# EAGLE design untitled (EAGLE 7.2.0)
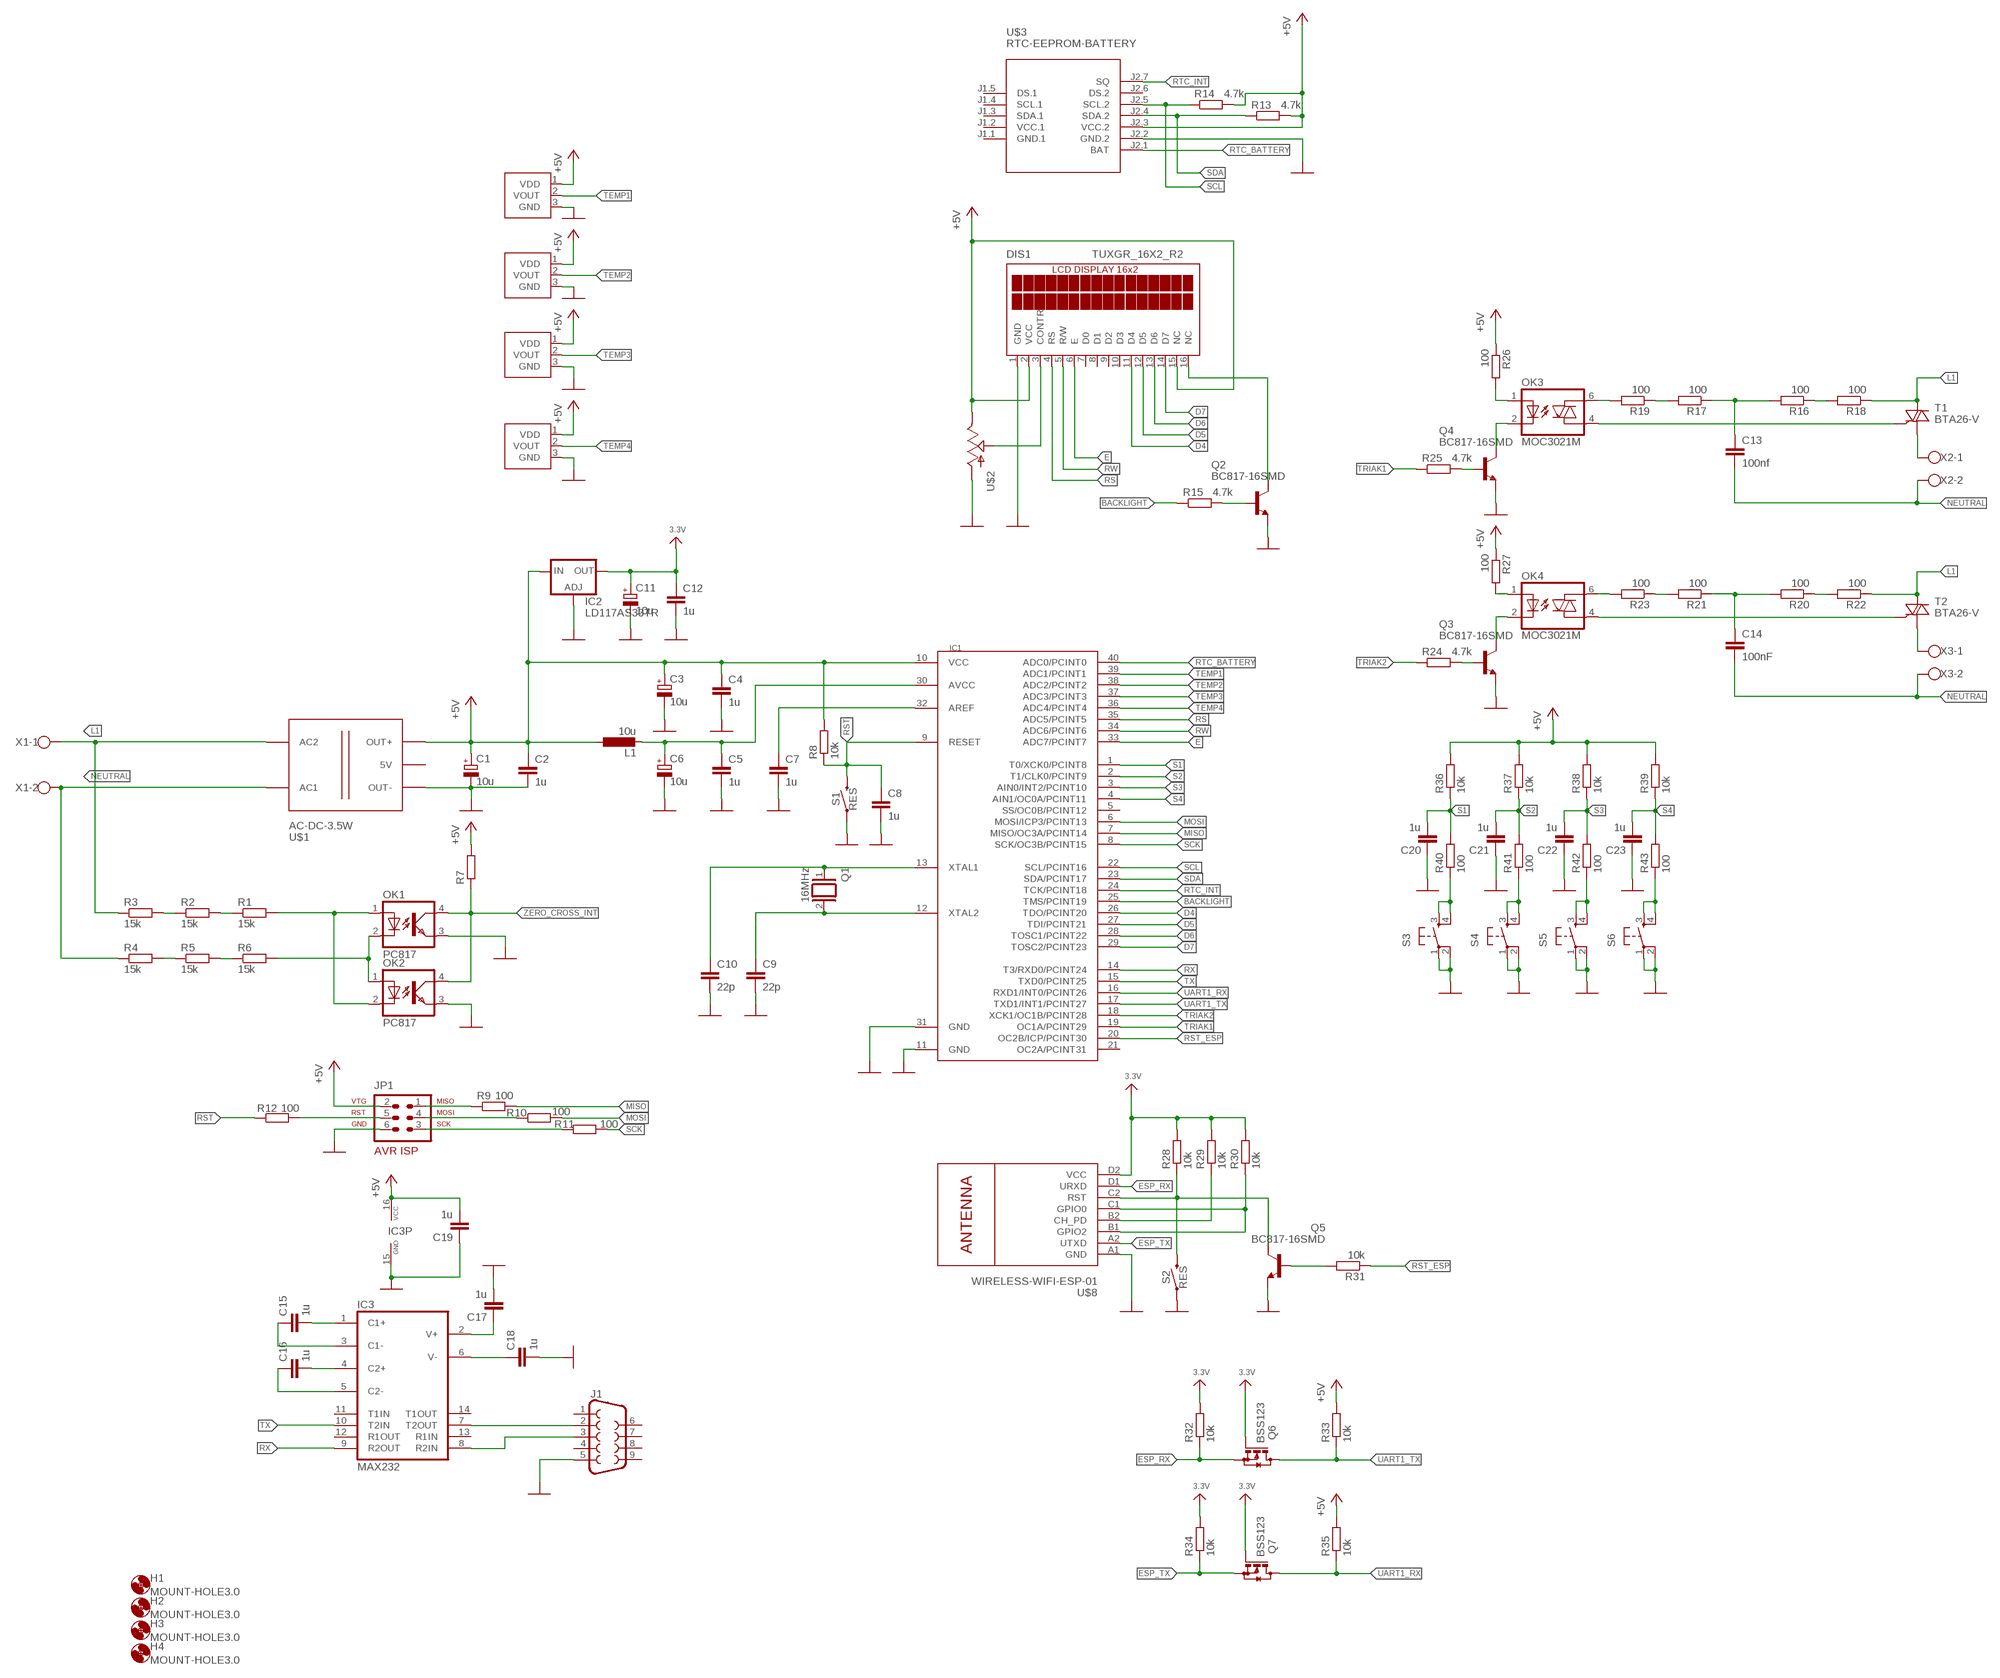
[diagram p0: schematic, sheet 1]

## Parts
C1  10u  CPOL-EU153CLV-0505  [153CLV-0505]
C2  1u  C-EUC1206  [C1206]
C3  10u  CPOL-EU153CLV-0505  [153CLV-0505]
C4  1u  C-EUC1206  [C1206]
C5  1u  C-EUC1206  [C1206]
C6  10u  CPOL-EU153CLV-0505  [153CLV-0505]
C7  1u  C-EUC1206  [C1206]
C8  1u  C-EUC1206  [C1206]
C9  22p  C-EUC1206  [C1206]
C10  22p  C-EUC1206  [C1206]
C11  10u  CPOL-EU153CLV-0505  [153CLV-0505]
C12  1u  C-EUC1206  [C1206]
C13  100nf  C-EU150-064X183  [C150-064X183]
C14  100nF  C-EU150-064X183  [C150-064X183]
C15  1u  C-EUC1206  [C1206]
C16  1u  C-EUC1206  [C1206]
C17  1u  C-EUC1206  [C1206]
C18  1u  C-EUC1206  [C1206]
C19  1u  C-EUC1206  [C1206]
C20  1u  C-EUC1206  [C1206]
C21  1u  C-EUC1206  [C1206]
C22  1u  C-EUC1206  [C1206]
C23  1u  C-EUC1206  [C1206]
DIS1  TUXGR_16X2_R2  [TUXGR_16X2_R2]
H1  MOUNT-HOLE3.0  [3,0]
H2  MOUNT-HOLE3.0  [3,0]
H3  MOUNT-HOLE3.0  [3,0]
H4  MOUNT-HOLE3.0  [3,0]
IC1  MEGA1284P  [DIL40]
IC2  LD117AS33TR  [SOT223]
IC3  MAX232  [DIL16]
J1  DB9FEMALE  [DB9]
JP1  AVR-ISP-6  [AVR-ISP-6]
L1  10u  L-EU0204/5  [0204/5]
OK1  PC817  [DIL04]
OK2  PC817  [DIL04]
OK3  MOC3021M  [DIL06]
OK4  MOC3021M  [DIL06]
Q1  16MHz  XTAL/S  [QS]
Q2  BC817-16SMD  [SOT23-BEC]
Q3  BC817-16SMD  [SOT23-BEC]
Q4  BC817-16SMD  [SOT23-BEC]
Q5  BC817-16SMD  [SOT23-BEC]
Q6  BSS123  [SOT23]
Q7  BSS123  [SOT23]
R1  15k  R-EU_M1206  [M1206]
R2  15k  R-EU_M1206  [M1206]
R3  15k  R-EU_M1206  [M1206]
R4  15k  R-EU_M1206  [M1206]
R5  15k  R-EU_M1206  [M1206]
R6  15k  R-EU_M1206  [M1206]
R7  R-EU_M1206  [M1206]
R8  10k  R-EU_M1206  [M1206]
R9  100  R-EU_M1206  [M1206]
R10  100  R-EU_M1206  [M1206]
R11  100  R-EU_M1206  [M1206]
R12  100  R-EU_M1206  [M1206]
R13  4.7k  R-EU_M1206  [M1206]
R14  4.7k  R-EU_M1206  [M1206]
R15  4.7k  R-EU_M1206  [M1206]
R16  100  R-EU_M1206  [M1206]
R17  100  R-EU_M1206  [M1206]
R18  100  R-EU_M1206  [M1206]
R19  100  R-EU_M1206  [M1206]
R20  100  R-EU_M1206  [M1206]
R21  100  R-EU_M1206  [M1206]
R22  100  R-EU_M1206  [M1206]
R23  100  R-EU_M1206  [M1206]
R24  4.7k  R-EU_M1206  [M1206]
R25  4.7k  R-EU_M1206  [M1206]
R26  100  R-EU_M1206  [M1206]
R27  100  R-EU_M1206  [M1206]
R28  10k  R-EU_M1206  [M1206]
R29  10k  R-EU_M1206  [M1206]
R30  10k  R-EU_M1206  [M1206]
R31  10k  R-EU_M1206  [M1206]
R32  10k  R-EU_M1206  [M1206]
R33  10k  R-EU_M1206  [M1206]
R34  10k  R-EU_M1206  [M1206]
R35  10k  R-EU_M1206  [M1206]
R36  10k  R-EU_M1206  [M1206]
R37  10k  R-EU_M1206  [M1206]
R38  10k  R-EU_M1206  [M1206]
R39  10k  R-EU_M1206  [M1206]
R40  100  R-EU_M1206  [M1206]
R41  100  R-EU_M1206  [M1206]
R42  100  R-EU_M1206  [M1206]
R43  100  R-EU_M1206  [M1206]
S1  RES  MOMENTARY-SWITCH-SPST-SMD-6.0X3.5MM  [TACTILE_SWITCH_SMD_6.0X3.5MM]
S2  RES  MOMENTARY-SWITCH-SPST-SMD-6.0X3.5MM  [TACTILE_SWITCH_SMD_6.0X3.5MM]
S3  TAC_SWITCHPTH  [TACTILE-PTH]
S4  TAC_SWITCHPTH  [TACTILE-PTH]
S5  TAC_SWITCHPTH  [TACTILE-PTH]
S6  TAC_SWITCHPTH  [TACTILE-PTH]
T1  BTA26-V  [TOP3S-1]
T2  BTA26-V  [TOP3S-1]
U$1  AC-DC-3.5W  [AC-DC-3.5W]
U$2  POTTRIM  [TRIM_POT]
U$3  RTC-EEPROM-BATTERY  [RTC-EEPROM-BATTERY]
U$4  MCP970XTO  [TO92]
U$5  MCP970XTO  [TO92]
U$6  MCP970XTO  [TO92]
U$7  MCP970XTO  [TO92]
U$8  WIRELESS-WIFI-ESP-01  [WIRELESS-WIFI-ESP-01]
X1  AK500/2  [AK500/2]
X2  AK500/2  [AK500/2]
X3  AK500/2  [AK500/2]

## Nets
3.3V: C11.+ C12.1 IC2.4(OUT) Q6.1(G) Q7.1(G) R28.2 R29.2 R30.2 R32.2 R34.2 U$8.D2(VCC)
+5V: C1.+ C2.1 C3.+ C4.1 C19.2 DIS1.2(VCC) DIS1.15(NC) IC1.10(VCC) IC2.3(IN) IC3.16(VCC) JP1.2 L1.1 R7.2 R8.2 R13.2 R14.2 R26.1 R27.1 R33.2 R35.2 R36.2 R37.2 R38.2 R39.2 U$1.J2.3(OUT+) U$2.2(E) U$3.J2.3(VCC.2) U$4.1(VDD) U$5.1(VDD) U$6.1(VDD) U$7.1(VDD)
BACKLIGHT: IC1.25(TMS/PCINT19) R15.1
D4: DIS1.11(D4) IC1.26(TDO/PCINT20)
D5: DIS1.12(D5) IC1.27(TDI/PCINT21)
D6: DIS1.13(D6) IC1.28(TOSC1/PCINT22)
D7: DIS1.14(D7) IC1.29(TOSC2/PCINT23)
E: DIS1.6(E) IC1.33(ADC7/PCINT7)
ESP_RST: Q5.C R28.1 S2.2 U$8.C2(RST)
ESP_RX: Q6.2(S) R32.1 U$8.D1(URXD)
ESP_TX: Q7.2(S) R34.1 U$8.A2(UTXD)
GND: C1.- C2.2 C3.- C4.2 C5.2 C6.- C7.2 C8.2 C9.2 C10.2 C11.- C12.2 C17.2 C18.2 C19.1 C20.1 C21.1 C22.1 C23.1 DIS1.1(GND) IC1.11(GND) IC1.31(GND) IC2.1(ADJ) IC3.15(GND) J1.5 JP1.6 OK1.3(EMIT) OK2.3(EMIT) Q2.E Q3.E Q4.E Q5.E S1.1 S2.1 S3.1 S3.2 S4.1 S4.2 S5.1 S5.2 S6.1 S6.2 U$1.J2.1(OUT-) U$2.3(A) U$3.J2.2(GND.2) U$4.3(GND) U$5.3(GND) U$6.3(GND) U$7.3(GND) U$8.A1(GND)
L1: R3.1 R18.1 R22.1 T1.A2 T2.A2 U$1.J1.2(AC2) X1.1
MISO: IC1.7(MISO/OC3A/PCINT14) R9.2
MOSI: IC1.6(MOSI/ICP3/PCINT13) R10.2
N$1: OK1.2(C) OK2.1(A) R6.2
N$2: OK1.1(A) OK2.2(C) R1.2
N$3: R2.1 R3.2
N$4: R1.1 R2.2
N$5: R5.2 R6.1
N$6: R4.2 R5.1
N$7: OK3.4(A1) T1.G
N$8: T1.A1 X2.1
N$9: C5.1 C6.+ IC1.30(AVCC) L1.2
N$10: JP1.5 R12.2
N$11: C9.1 IC1.12(XTAL2) Q1.2
N$12: C7.1 IC1.32(AREF)
N$13: C10.1 IC1.13(XTAL1) Q1.1
N$14: JP1.1 R9.1
N$15: JP1.4 R10.1
N$16: JP1.3 R11.1
N$17: Q2.B R15.2
N$18: DIS1.3(CONTR) U$2.1(S)
N$19: Q5.B R31.2
N$20: OK3.6(A2) R19.2
N$21: R17.2 R19.1
N$22: C13.1 R16.2 R17.1
N$23: R16.1 R18.2
N$24: OK4.6(A2) R23.2
N$25: R21.2 R23.1
N$26: C14.1 R20.2 R21.1
N$27: DIS1.16(NC) Q2.C
N$28: R20.1 R22.2
N$29: OK4.4(A1) T2.G
N$30: T2.A1 X3.1
N$31: OK3.1(A) R26.2
N$32: OK3.2(C) Q4.C
N$33: OK4.1(A) R27.2
N$34: OK4.2(C) Q3.C
N$35: Q3.B R24.2
N$36: Q4.B R25.2
N$37: R29.1 U$8.B2(CH_PD)
N$38: R30.1 U$8.B1(GPIO2) U$8.C1(GPIO0)
N$39: C15.2 IC3.1(C1+)
N$40: R40.1 S3.3 S3.4
N$41: C16.2 IC3.4(C2+)
N$42: R41.1 S4.3 S4.4
N$43: C15.1 IC3.3(C1-)
N$44: C16.1 IC3.5(C2-)
N$45: C17.1 IC3.2(V+)
N$46: C18.1 IC3.6(V-)
N$47: R42.1 S5.3 S5.4
N$48: R43.1 S6.3 S6.4
N$49: IC3.7(T2OUT) J1.2
N$50: IC3.8(R2IN) J1.3
NEUTRAL: C13.2 C14.2 R4.1 U$1.J1.1(AC1) X1.2 X2.2 X3.2
RS: DIS1.4(RS) IC1.35(ADC5/PCINT5)
RST: C8.1 IC1.9(RESET) R8.1 R12.1 S1.2
RST_ESP: IC1.20(OC2B/ICP/PCINT30) R31.1
RTC_BATTERY: IC1.40(ADC0/PCINT0) U$3.J2.1(BAT)
RTC_INT: IC1.24(TCK/PCINT18) U$3.J2.7(SQ)
RW: DIS1.5(R/W) IC1.34(ADC6/PCINT6)
RX: IC1.14(T3/RXD0/PCINT24) IC3.9(R2OUT)
S1: C20.2 IC1.1(T0/XCK0/PCINT8) R36.1 R40.2
S2: C21.2 IC1.2(T1/CLK0/PCINT9) R37.1 R41.2
S3: C22.2 IC1.3(AIN0/INT2/PCINT10) R38.1 R42.2
S4: C23.2 IC1.4(AIN1/OC0A/PCINT11) R39.1 R43.2
SCK: IC1.8(SCK/OC3B/PCINT15) R11.2
SCL: IC1.22(SCL/PCINT16) R14.1 U$3.J2.5(SCL.2)
SDA: IC1.23(SDA/PCINT17) R13.1 U$3.J2.4(SDA.2)
TEMP1: IC1.39(ADC1/PCINT1) U$7.2(VOUT)
TEMP2: IC1.38(ADC2/PCINT2) U$6.2(VOUT)
TEMP3: IC1.37(ADC3/PCINT3) U$5.2(VOUT)
TEMP4: IC1.36(ADC4/PCINT4) U$4.2(VOUT)
TRIAK1: IC1.19(OC1A/PCINT29) R25.1
TRIAK2: IC1.18(XCK1/OC1B/PCINT28) R24.1
TX: IC1.15(TXD0/PCINT25) IC3.10(T2IN)
UART1_RX: IC1.16(RXD1/INT0/PCINT26) Q7.3(D) R35.1
UART1_TX: IC1.17(TXD1/INT1/PCINT27) Q6.3(D) R33.1
ZERO_CROSS_INT: OK1.4(COL) OK2.4(COL) R7.1
Unconnected: DIS1.7(D0) DIS1.8(D1) DIS1.9(D2) DIS1.10(D3) IC1.5(SS/OC0B/PCINT12) IC1.21(OC2A/PCINT31) IC3.11(T1IN) IC3.12(R1OUT) IC3.13(R1IN) IC3.14(T1OUT) J1.1 J1.4 J1.6 J1.7 J1.8 J1.9 U$1.J2.2(5V) U$3.J1.3(SDA.1) U$3.J1.4(SCL.1) U$3.J1.5(DS.1) U$3.J2.6(DS.2)

## Power pins joined to a net without a drawn wire
GND.1: U$3.J1.1(GND.1)
VCC.1: U$3.J1.2(VCC.1)

## Library data of the parts
C1 C3 C6 C11 = rcl:CPOL-EU: POLARIZED CAPACITOR, European symbol
C2 C4 C5 C7-C10 C12-C23 = rcl:C-EU: CAPACITOR, European symbol
DIS1 = display-lcd:TUXGR_16X2_R2: Tuxgraphics LCD display 16x2 characters reflective, without background light Source: tuxgr_12x2_r2.pdf; OC_FARNELL: unknown; OC_NEWARK: unknown
H1-H4 = holes:MOUNT-HOLE: MOUNTING HOLE with drill center marker
IC1 = 1284p:MEGA1284P: Atmel ATmega1284P 8-bit AVR Microcontroller
IC2 = v-reg:LD117A?*: Low drop fixed and adjustable positive voltage regulators 1 A Source: http://www.st.com/stonline/products/literature/ds/7194/ld1117axx.pdf
IC3 = maxim:MAX232: RS232 TRANSEIVER; MF: MAXIM; MPN: MAX232ACPE+; OC_FARNELL: 9723773; OC_NEWARK: 68K4544
J1 = SparkFun-Connectors:DB9: DB9 Connector Standard DB9 (D-Sub 9) serial connector. Can be used for CAN bus as well as RS485 and RS232. Footprint production proven. Here is the female version connector we sell at SparkFun: 9 Pin Female Serial Connector - PCB Mount <https://www.sparkfun.com/products/429> (PRT-00429) This connector has been used on the following SparkFun products: SparkFun RS232 Shifter - SMD <https://www.sparkfun.com/products/449> (PRT-00449) SparkFun RS232 Shifter SMD (No DB9) <https://www.sparkfun.com/products/8780> (PRT-08780); PROD_ID: CONN-08194
JP1 = atmel-1:AVR-ISP-6: AVR ISP-6 Serial Programming Header
L1 = rcl:L-EU: INDUCTOR, European symbol
OK1 OK2 = optocoupler:PC817: SHARP OPTO COUPLER; MPN: PC817X4J000F; OC_FARNELL: 9707727; OC_NEWARK: 97K7059
OK3 OK4 = optocoupler-2:MOC30*M: RANDOM-PHASE OPTOISOLATORS TRIAC DRIVER OUTPUT Source: http://www.fairchildsemi.com MOC3020-M.pdf
Q1 = special:XTAL/S: CRYSTAL
Q2-Q5 = transistor-npn:BC817*: NPN Transistor
Q6 Q7 = transistor-small-signal:BSS123: N-CHANNEL MOS FET
R1-R43 = rcl:R-EU_: RESISTOR, European symbol
S1 S2 = SparkFun-Switches:MOMENTARY-SWITCH-SPST: Momentary Switch (Pushbutton) - SPST Normally-open (NO) SPST momentary switches (buttons, pushbuttons). Variants PTH-12MM - 12mm square, through-hole Momentary Pushbutton Switch - 12mm Square <https://www.sparkfun.com/products/9190> (COM-09190) PTH-6.0MM, PTH-6.0MM-KIT - 6.0mm square, through-hole Mini Pushbutton Switch <https://www.sparkfun.com/products/97> (COM-00097) KIT package intended for soldering kit's - only one side of pads' copper is exposed. PTH-RIGHT-ANGLE-KIT - Right-angle, through-hole Right Angle Tactile Button <https://www.sparkfun.com/products/10791> - Used on SparkFun BigTime Watch Kit <https://www.sparkfun.com/products/11734> SMD-12MM - 12mm square, surface-mount Tactile Button - SMD (12mm) <https://www.sparkfun.com/products/12993> (COM-12993) Used on SparkFun PicoBoard <https://www.sparkfun.com/products/11888> SMD-4.5MM - 4.5mm Square Trackball Switch Used on SparkFun Blackberry Trackballer Breakout <https://www.sparkfun.com/products/13169> SMD-4.6MMX2.8MM - 4.60mm x 2.80mm, surface mount Used on SparkFun SAMD21 Mini Breakout <https://www.sparkfun.com/products/13664> SMD-5.2MM, SMD-5.2-REDUNDANT - 5.2mm square, surface-mount Mini Pushbutton Switch - SMD <https://www.sparkfun.com/products/8720> (COM-08720) Used on Arduino Pro Mini <https://www.sparkfun.com/products/11114> REDUNDANT package connects both switch circuits together SMD-6.0X3.5MM - 6.0 x 3.5mm, surface mount Momentary Reset Switch SMD <https://www.sparkfun.com/products/8229> (COM-08229) SMD-6.2MM-TALL - 6.2mm square, surface mount Tactile Button - SMD (6mm) <https://www.sparkfun.com/products/12992> Used on SparkFun Digital Sandbox <https://www.sparkfun.com/products/12651> SMD-RIGHT-ANGLE - Right-angle, surface mount Used on SparkFun Block for Intel® Edison - Arduino <https://www.sparkfun.com/products/13036>; PROD_ID: SWCH-00815; SF_SKU: COM-08229
S3-S6 = SparkFun:TAC_SWITCH: Momentary Switch Button commonly used for reset or general input. Spark Fun Electronics SKU : COM-00097
T1 T2 = triac:BTA26: 25A TRIAC Source: http://www.st.com/stonline/products/literature/ds/7470.pdf
U$1 = diy-modules:AC-DC-3.5W: AC/DC 3.5W Converter More details available here: https://www.itead.cc/wiki/AC-DC_Power_Module_5V_700mA Click here to find device on ebay.com <http://www.ebay.com/sch/ac+dc+3.5w+buck+step>
U$2 = SparkFun:POT
U$3 = diy-modules:RTC-EEPROM-BATTERY: RTC Module with Battery and EEPROM based on DS1307 and AT24C32 chips More details available here: http://henrysbench.capnfatz.com/henrys-bench/arduino-sensors-and-input/arduino-tiny-rtc-d1307-tutorial/ Click here to find device on ebay.com <http://www.ebay.com/sch/tiny+rtc+arduino>
U$4-U$7 = mcp970x:MCP970X
U$8 = diy-modules:WIRELESS-WIFI-ESP-01: Wireless Wi-Fi ESP-01 Module based on ESP8266 chip Click here to find device on ebay.com <http://www.ebay.com/sch/esp8266+esp+01+transceiver>
X1-X3 = con-ptr500+:AK500/2: CONNECTOR

## Board
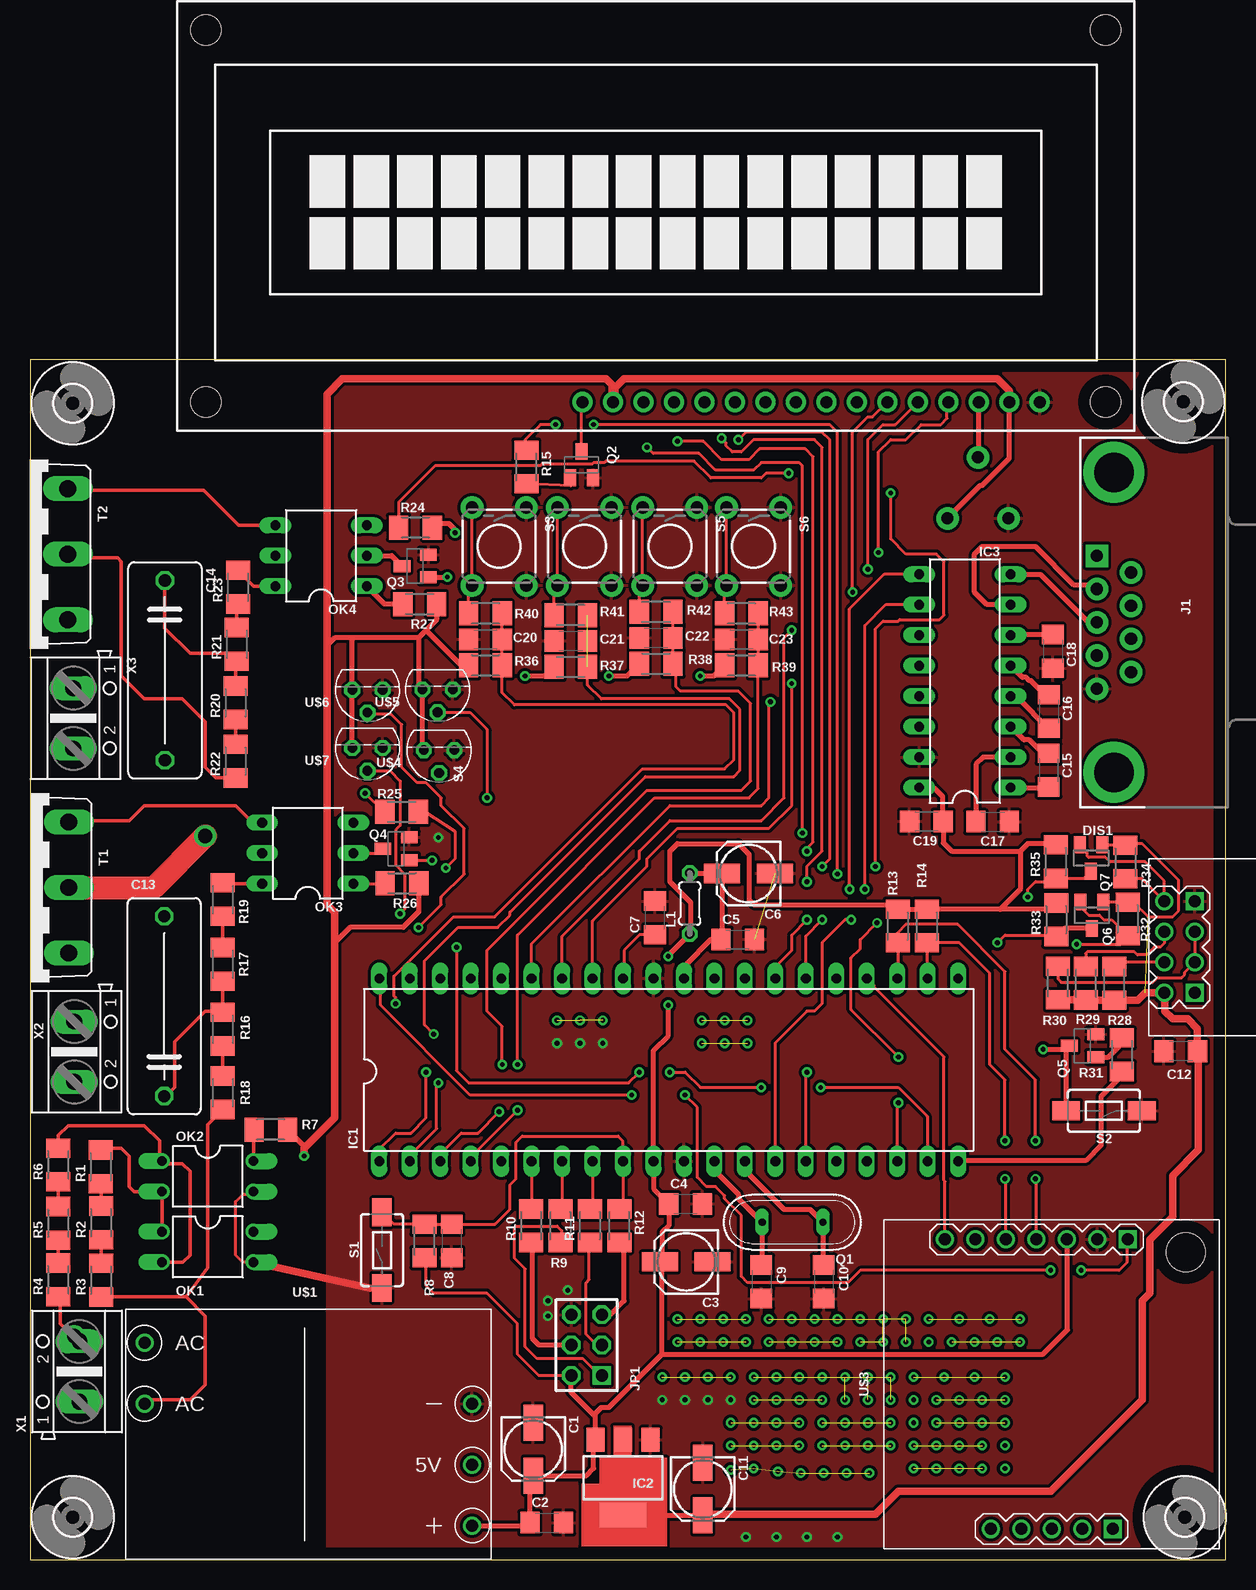
[diagram p1: board, top side]
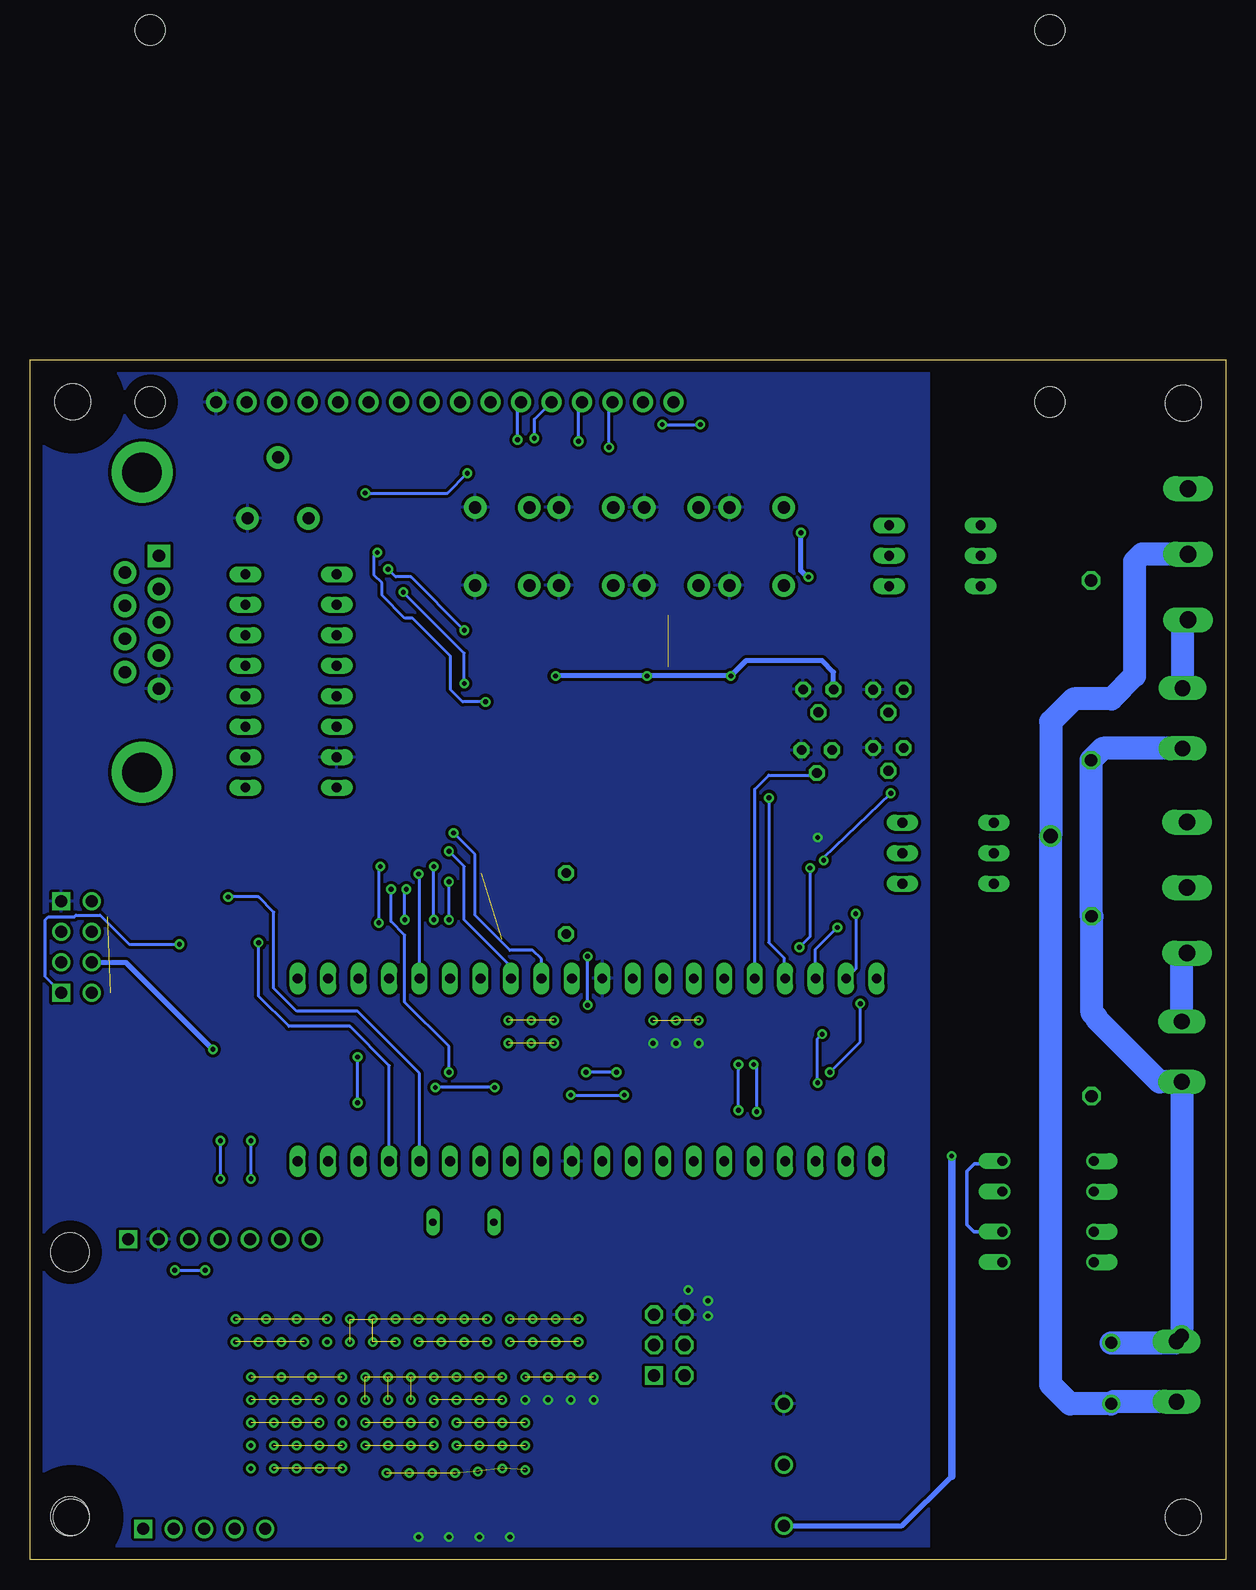
[diagram p2: board, bottom side, seen from below]

Size 99.7 x 100 mm. Coordinates in mm from the lower left corner, seen from the top.
Outline: 0,0 99.7,0 99.7,100 0,100 0,0
Copper layers (1*16): Top 0.035mm / dielectric 1.5mm / Bottom 0.035mm
Design rules "default": minimum track width 10mil, minimum drill 24mil, track to track 8mil, track to pad 8mil, pad to pad 8mil, via to via 8mil, smd to smd 8mil, copper to edge 40mil, drill to drill 8mil, minimum pad ring 10mil, minimum via ring 8mil, stop-mask expansion 4mil, vias tented up to drill 0mil, thermal gap 10mil

### Footprints (pad centres in the part's own frame; a part is rotated, then mirrored left to right if it is on the bottom)
153CLV-0505 = smd 3 x 1.6: + 2.2,0; - -2.2,0
C1206 = smd 1.6 x 1.8: 1 -1.4,0; 2 1.4,0
C150-064X183 = drill 1.016 octagon: 1 -7.493,0; 2 7.493,0
TUXGR_16X2_R2 = drill 1 pad 1.676: 1 -32,15.5; 2 -29.46,15.5; 3 -26.92,15.5; 4 -24.38,15.5; 5 -21.84,15.5; 6 -19.3,15.5; 7 -16.76,15.5; 8 -14.22,15.5; 9 -11.68,15.5; 10 -9.14,15.5; 11 -6.6,15.5; 12 -4.06,15.5; 13 -1.52,15.5; 14 1.02,15.5; 15 3.56,15.5; 16 6.1,15.5 | hole 2.5: -37.5,-15.5; 37.5,-15.5; -37.5,15.5; 37.5,15.5
3,0 = hole 3: 0,0
DIL40 = drill 0.813 long: 1 -24.13,-7.62; 2 -21.59,-7.62; 3 -19.05,-7.62; 4 -16.51,-7.62; 5 -13.97,-7.62; 6 -11.43,-7.62; 7 -8.89,-7.62; 8 -6.35,-7.62; 9 -3.81,-7.62; 10 -1.27,-7.62; 11 1.27,-7.62; 12 3.81,-7.62; 13 6.35,-7.62; 14 8.89,-7.62; 15 11.43,-7.62; 16 13.97,-7.62; 17 16.51,-7.62; 18 19.05,-7.62; 19 21.59,-7.62; 20 24.13,-7.62; 21 24.13,7.62; 22 21.59,7.62; 23 19.05,7.62; 24 16.51,7.62; 25 13.97,7.62; 26 11.43,7.62; 27 8.89,7.62; 28 6.35,7.62; 29 3.81,7.62; 30 1.27,7.62; 31 -1.27,7.62; 32 -3.81,7.62; 33 -6.35,7.62; 34 -8.89,7.62; 35 -11.43,7.62; 36 -13.97,7.62; 37 -16.51,7.62; 38 -19.05,7.62; 39 -21.59,7.62; 40 -24.13,7.62
SOT223 = smd 1.5 x 2: 1 -2.3,-3.15; 2 0,-3.15; 3 2.3,-3.15 | smd 3.8 x 2: 4 0,3.15
DIL16 = drill 0.813 long: 1 -8.89,-3.81; 2 -6.35,-3.81; 3 -3.81,-3.81; 4 -1.27,-3.81; 5 1.27,-3.81; 6 3.81,-3.81; 7 6.35,-3.81; 8 8.89,-3.81; 9 8.89,3.81; 10 6.35,3.81; 11 3.81,3.81; 12 1.27,3.81; 13 -1.27,3.81; 14 -3.81,3.81; 15 -6.35,3.81; 16 -8.89,3.81
DB9 = drill 1.016 pad 1.88 square: 1 -5.54,-1.42 | drill 1.016 pad 1.88: 2 -2.77,-1.42; 3 0,-1.42; 4 2.77,-1.42; 5 5.54,-1.42; 6 -4.15,1.42; 7 -1.38,1.42; 8 1.38,1.42; 9 4.15,1.42 | drill 3.302 pad 5.08: G1 -12.5,0; G2 12.5,0
AVR-ISP-6 = drill 1.016 square: 1 -2.54,-1.27 | drill 1.016 octagon: 2 -2.54,1.27; 3 0,-1.27; 4 0,1.27; 5 2.54,-1.27; 6 2.54,1.27
0204/5 = drill 0.813 octagon: 1 -2.54,0; 2 2.54,0
DIL04 = drill 0.813 offset: 1 -1.27,-3.81; 2 1.27,-3.81; 3 1.27,3.81; 4 -1.27,3.81
DIL06 = drill 0.813 long: 1 -2.54,-3.81; 2 0,-3.81; 3 2.54,-3.81; 4 2.54,3.81; 5 0,3.81; 6 -2.54,3.81
QS = drill 0.61 long: 1 -2.54,0; 2 2.54,0
SOT23-BEC = smd 1 x 1.4: B -0.95,-1.1; C 0,1.1; E 0.95,-1.1
SOT23 = smd 1 x 1.4: 1 -0.95,-1.1; 2 0.95,-1.1; 3 0,1.1
M1206 = smd 1.6 x 2: 1 -1.4,0; 2 1.4,0
TACTILE_SWITCH_SMD_6.0X3.5MM = smd 2.3 x 1.6: 1 -3.15,0; 2 3.15,0
TACTILE-PTH = drill 1.016 pad 1.88: 1 -3.251,2.261; 2 3.251,2.261; 3 -3.251,-2.261; 4 3.251,-2.261
TOP3S-1 = drill 1.397 long: A1 -5.461,-3.175; A2 0,-3.175; G 5.461,-3.175
AC-DC-3.5W = drill 1: J1.1 -13.335,7.62; J1.2 -13.335,2.54; J2.1 13.97,2.54; J2.2 13.97,-2.54; J2.3 13.97,-7.62
TRIM_POT = drill 1 pad 1.88: 1 5.08,0; 2 0,2.54; 3 0,-2.54
RTC-EEPROM-BATTERY = drill 1 square: J1.1 -12.065,-5.08; J2.1 12.065,-6.35 | drill 1: J1.2 -12.065,-2.54; J1.3 -12.065,0; J1.4 -12.065,2.54; J1.5 -12.065,5.08; J2.2 12.065,-3.81; J2.3 12.065,-1.27; J2.4 12.065,1.27; J2.5 12.065,3.81; J2.6 12.065,6.35; J2.7 12.065,8.89 | hole 3.2: -11,-11.176; 11,-11.176
TO92 = drill 0.813 octagon: 1 1.27,0; 2 0,1.905; 3 -1.27,0
WIRELESS-WIFI-ESP-01 = drill 1 square: A1 -8.89,3.81; D1 -8.89,-3.81 | drill 1: A2 -11.43,3.81; B1 -8.89,1.27; B2 -11.43,1.27; C1 -8.89,-1.27; C2 -11.43,-1.27; D2 -11.43,-3.81
AK500/2 = drill 1.321 long: 1 -2.515,0; 2 2.515,0

### Placement (x,y rotation side)
C1  41.95,9.22 270 top
C2  43.09,3.11 0 top
C3  54.72,24.84 180 top
C4  54.65,29.67 0 top
C5  59,51.7 0 top
C6  59.9,57.2 180 top
C7  52.1,53.5 90 top
C8  35.16,26.57 270 top
C9  60.97,23.18 270 top
C10  66.17,23.18 270 top
C11  56.09,5.91 270 top
C12  95.93,42.39 180 top
C13  11.19,46.14 90 top
C14  11.25,74.13 270 top
C15  84.91,65.81 270 top
C16  84.94,70.7 270 top
C17  80.25,61.52 0 top
C18  85.27,75.71 270 top
C19  74.73,61.54 0 top
C20  37.97,76.71 0 top
C21  45.09,76.58 0 top
C22  52.2,76.83 0 top
C23  59.31,76.71 0 top
DIS1  52.17,111.99 180 top
H1  3.56,96.39 0 top
H2  96.27,3.56 0 top
H3  96.14,96.52 0 top
H4  3.56,3.56 0 top
IC1  53.25,40.84 0 top
IC2  49.44,6.85 180 top
IC3  77.94,73.25 90 top
J1  90.36,78.13 270 top
JP1  46.41,17.9 90 top
L1  55,54.7 90 top
OK1  14.82,26.08 270 top
OK2  14.82,31.96 270 top
OK3  23.16,58.89 90 top
OK4  24.27,83.68 90 top
Q1  63.57,28.14 180 top
Q2  45.99,91.27 0 top
Q3  32.12,82.82 90 top
Q4  30.52,59.27 90 top
Q5  87.74,42.84 90 top
Q6  88.52,53.72 180 top
Q7  88.46,58.49 180 top
R1  5.9,32.75 90 top
R2  5.93,28.09 90 top
R3  5.93,23.31 90 top
R4  2.35,23.33 90 top
R5  2.35,28.05 90 top
R6  2.35,32.91 90 top
R7  20.08,35.87 0 top
R8  32.89,26.57 270 top
R9  44.21,27.84 90 top
R10  41.78,27.85 90 top
R11  46.67,27.84 90 top
R12  49.13,27.84 270 top
R13  72.34,52.82 90 top
R14  74.75,52.82 90 top
R15  41.39,91.07 270 top
R16  16.07,44.23 90 top
R17  16.07,49.62 90 top
R18  16.07,38.92 90 top
R19  16.07,55.02 90 top
R20  17.14,71.43 90 top
R21  17.23,76.3 90 top
R22  17.14,66.56 90 top
R23  17.34,81.06 90 top
R24  32.13,86.02 0 top
R25  30.98,62.33 180 top
R26  31.02,56.39 180 top
R27  32.48,79.66 180 top
R28  90.39,48.05 270 top
R29  88.03,48.05 270 top
R30  85.69,48.07 270 top
R31  91.03,42.1 90 top
R32  91.5,53.41 90 top
R33  85.56,53.35 90 top
R34  91.31,58.15 90 top
R35  85.5,58.19 90 top
R36  37.97,74.55 180 top
R37  45.09,74.42 180 top
R38  52.2,74.68 180 top
R39  59.31,74.55 180 top
R40  37.97,78.87 0 top
R41  45.09,78.74 0 top
R42  52.2,78.99 0 top
R43  59.31,78.87 0 top
S1  29.34,25.82 90 top
S2  89.53,37.42 180 top
S3  39.12,84.45 270 top
S4  46.23,84.45 270 top
S5  53.34,84.45 270 top
S6  60.33,84.45 270 top
T1  0.06,56.03 90 top
T2  -0.02,83.8 90 top
U$1  22.89,10.47 0 top
U$2  79.03,86.8 90 top
U$3  85.18,14.64 90 top
U$4  34.1,67.48 180 top
U$5  33.98,72.54 180 top
U$6  28.14,72.51 180 top
U$7  28.14,67.66 180 top
U$8  105.98,51.06 0 top
X1  4.12,15.7 90 top
X2  3.69,42.34 270 top
X3  3.61,70.13 270 top

### Tracks (layer width: path | path; a pad name or v marks a point on that pad's centre or on a via)
3.3V  (1 unrouted)
  Top 0.254: Q6.1 R32.2 92,54.81 93.22,53.59 95.25,53.59 95.76,54.1 95.76,56.64 92.71,59.69 91.45,59.69 R34.2 91.27,59.59 Q7.1
  Top 0.406: IC2.4 C11.+
  Top 0.61: C11.+ 56.19,3.81 70.48,3.81 72.39,5.71 85.09,5.71 92.71,13.34 92.71,21.59 93.34,22.23 93.34,26.67 95.25,28.57 95.25,32 97.41,34.16 97.41,42.31 C12.1 97.33,44.27 96.52,45.09 95.25,45.09 94.61,45.72 94.61,46.62 | U$8.D2 94.35,47.25 | 93.98,47.25 92.97,47.25 92.37,46.65 R28.2 90.38,46.66 R29.2 88.01,46.67 R30.2 | 94.61,46.62 93.98,47.25 | 93.98,47.25 94.35,47.25 | 94.35,47.25 94.61,46.99 94.61,46.62
+5V  (via drill 0.4)
  Top 0.254: JP1.2 42.42,15.36 40.64,17.14 40.64,19.68 38.1,22.23 33.66,22.23 33.02,22.86 33.02,25.04 R8.2
  Top 0.406: U$1.J2.3 41.43,2.85 C2.1 41.69,6.76 C1.+ 46.4,7.03 46.99,7.62 46.99,9.86 IC2.3 | IC2.3 47.13,11.92 45.09,13.97 45.09,15.31 JP1.2 | v22.86,33.66 22.86,34.48 R7.2 | IC2.3 47.13,12.21 47.62,12.7 48.26,12.7 52.7,17.14 | 52.7,17.14 52.7,24.64 C3.+ 52.7,25.02 52.7,27.3 53.25,27.85 C4.1 51.98,30.94 IC1.10 51.98,42.46 53.21,43.69 v53.21,46.23 | v53.21,50.29 53.21,50.37 L1.1 | 48.51,96.59 DIS1.15 48.9,96.78 48.9,97.79 | R27.1 33.88,78.33 33.02,77.47 | 33.02,77.47 32.38,76.83 | 32.38,76.83 26.67,76.83 | 26.67,76.83 25.4,76.83 24.77,76.2 | R26.1 32.41,54.01 31.11,52.7 26.67,52.7 25.4,51.44 | R33.2 85.03,54.22 80.89,54.22 | 80.89,54.22 R14.2 R13.2 72.34,54.56 72.39,54.61 60.33,54.61 59.94,54.99 59.94,58.8 59.05,59.69 53.98,59.69 53.34,59.05 53.34,56.52 55.09,54.77 v55.09,52.07 | R35.2 85.4,59.69 83.19,59.69 82.55,59.05 | 82.55,59.05 82.55,55.88 80.89,54.22 | U$2.2 79.22,89.53 79.38,89.53 81.63,91.79 DIS1.2 | 52.7,17.14 84.45,17.14 86.49,19.18 86.49,26.66 U$3.J2.3 | 82.55,59.05 76.83,59.05 76.13,59.76 C19.2 76.07,61.6 76.07,63.63 75.34,64.36 IC3.16 | 26.67,76.83 26.86,76.64 U$6.1 U$7.1 | 32.38,76.83 32.38,72.86 U$5.1 32.71,67.61 U$4.1 | R36.2 35.94,74.55 33.02,77.47 | v41.27,73.66 42.92,73.66 R37.2 | v48.26,73.66 49.78,73.66 R38.2 | v55.88,73.66 57.02,73.66 R39.2
  Top 0.61: v22.86,33.66 22.86,34.29 25.4,36.83 25.4,51.44 25.4,53.98 24.77,54.61 24.77,76.2 24.77,97.16 26.04,98.42 48.01,98.42 48.51,97.92 48.51,96.59 | 48.9,97.79 49.53,98.42 80.64,98.42 81.63,97.44 DIS1.2
  Bottom 0.254: v53.21,46.23 v53.21,50.29
  Bottom 0.406: U$1.J2.3 27,2.85 22.86,6.99 | L1.1 v55.09,52.07 | U$5.1 32.71,73.98 33.66,74.93 40.01,74.93 v41.27,73.66 v48.26,73.66 v55.88,73.66
  Bottom 0.61: 22.86,6.99 v22.86,33.66
BACKLIGHT  (via drill 0.4)
  Top 0.254: v67.31,57.15 67.31,93.98 66.67,94.61 v46.99,94.61 | v43.81,94.61 42.55,94.61 41.27,93.34 41.27,92.58 R15.1
  Bottom 0.254: IC1.25 67.22,57.06 v67.31,57.15 | v46.99,94.61 v43.81,94.61
D4  (via drill 0.4)
  Top 0.254: IC1.26 64.68,51.98 v66.04,53.34 | v66.04,57.78 66.67,58.42 66.67,93.34 66.04,93.98 59.69,93.98 v59.05,93.34
  Bottom 0.254: v66.04,53.34 v66.04,57.78 | v59.05,93.34 59.05,96.2 DIS1.11
D5  (via drill 0.4)
  Top 0.254: IC1.27 62.14,49.44 63.5,50.8 63.5,52.07 v64.77,53.34 | v64.77,56.52 64.77,57.78 66.04,59.05 66.04,92.71 65.41,93.34 60.33,93.34 59.31,92.33 58.55,92.33 58.04,92.84 58.04,93.09 v57.66,93.47
  Bottom 0.254: v64.77,53.34 v64.77,56.52 | v57.66,93.47 57.66,95.06 DIS1.12
D6  (via drill 0.4)
  Top 0.254: v64.77,59.05 64.77,59.31 65.28,59.82 65.28,91.95 64.64,92.58 60.83,92.58 59.94,91.69 57.66,91.69 56.13,93.22 v53.98,93.22
  Bottom 0.254: IC1.28 59.6,49.44 63.5,53.34 63.5,57.78 v64.77,59.05 | v53.98,93.22 53.98,96.2 DIS1.13
D7  (via drill 0.4)
  Top 0.254: v64.39,60.58 64.39,91.19 64.14,91.44 60.96,91.44 60.33,90.81 57.15,90.81 55.75,92.2 51.94,92.2 v51.44,92.71
  Bottom 0.254: IC1.29 57.06,50.08 57.78,50.8 59.69,50.8 62.61,53.72 62.61,58.8 v64.39,60.58 | v51.44,92.71 51.44,96.2 DIS1.14
E  (via drill 0.4)
  Top 0.254: IC1.33 46.9,53.25 51.44,57.78 51.44,58.42 53.98,60.96 61.59,60.96 63.5,62.87 v63.5,73.03 | v68.58,80.64 68.58,93.98 69.85,95.25 70.23,95.25 DIS1.6
  Bottom 0.254: v63.5,73.03 63.5,75.56 v68.58,80.64
ESP_RST  (via drill 0.4)
  Top 0.254: U$8.C2 90.73,49.79 R28.1
  Top 0.406: S2.2 86.39,42.59 Q5.C 86.34,42.55 v84.45,42.55
  Bottom 0.406: U$8.C2 91.7,49.79 v84.45,42.55
ESP_RX  (via drill 0.4)
  Top 0.254: Q6.2 87.57,54.42 88.27,53.72 89.15,53.72 89.53,53.34 90.18,53.34 R32.1 91.5,51.88 90.93,51.31 v87.25,51.31
  Bottom 0.254: U$8.D1 98.42,48.59 98.42,53.34 98.17,53.59 96.01,53.59 95.89,53.72 93.85,53.72 91.44,51.31 v87.25,51.31
ESP_TX
  Top 0.254: Q7.2 88.14,58.96 88.14,58.67 88.27,58.55 89.66,58.55 90.04,58.17 92.96,58.17 94.55,56.58 U$8.A2 92.67,56.75 R34.1
GND  (via drill 0.4)  (1 unrouted)
  Top 0.254: OK1.3 17.73,24.81 17.14,25.4 17.14,29.84 17.78,30.48 18.41,30.48 OK2.3 | 28.34,22.65 S1.1
  Top 0.61: OK1.3 28.34,22.65
  other vias: 43.18,20.32 43.18,21.59 44.83,22.48 59.69,1.91 62.23,1.91 64.77,1.91 67.31,1.91 52.7,13.34 54.61,13.34 56.52,13.34 58.42,13.34 34.04,60.2 43.94,43.05 45.85,43.05 47.75,43.05
  pour Top (isolate 0.254): 24.77,99.69 24.77,-0.64 99.69,-0.64 99.69,99.69
  pour Bottom (isolate 0.254): 24.77,100.33 99.69,100.33 99.69,0 24.77,0
GND1  (via drill 0.4)  (6 unrouted)
  other vias: 58.42,7.49 60.33,7.62 62.36,7.37 64.26,7.24 66.17,7.24 68.07,7.24 69.98,7.24
GND2  (via drill 0.4)  (3 unrouted)
  other vias: 73.66,15.24 76.2,15.24 78.74,15.24 81.28,15.24
GND3  (via drill 0.4)  (3 unrouted)
  other vias: 60.33,13.34 62.23,13.34 64.14,13.34 66.04,13.34
GND4  (via drill 0.4)  (3 unrouted)
  other vias: 52.7,15.24 54.61,15.24 56.52,15.24 58.42,15.24
GND5  (via drill 0.4)  (9 unrouted)
  other vias: 60.33,15.24 62.23,15.24 64.14,15.24 66.04,15.24 67.94,15.24 69.85,15.24 71.75,15.24 71.75,13.34 69.85,13.34 67.94,13.34
GND6  (via drill 0.4)  (3 unrouted)
  other vias: 58.42,9.53 60.33,9.53 62.23,9.53 64.14,9.53
GND7  (via drill 0.4)  (3 unrouted)
  other vias: 66.04,9.53 67.94,9.53 69.85,9.53 71.75,9.53
GND8  (via drill 0.4)  (3 unrouted)
  other vias: 58.42,11.43 60.33,11.43 62.23,11.43 64.14,11.43
GND9  (via drill 0.4)  (3 unrouted)
  other vias: 66.04,11.43 67.94,11.43 69.85,11.43 71.75,11.43
GND10  (via drill 0.4)
  other vias: 73.66,11.43
GND11  (via drill 0.4)  (3 unrouted)
  other vias: 75.56,11.43 77.47,11.43 79.38,11.43 81.28,11.43
GND12  (via drill 0.4)
  other vias: 73.66,13.34
GND13  (via drill 0.4)  (3 unrouted)
  other vias: 75.56,13.34 77.47,13.34 79.38,13.34 81.28,13.34
GND14  (via drill 0.4)  (3 unrouted)
  other vias: 73.66,7.62 75.56,7.62 77.47,7.62 79.38,7.62
GND15  (via drill 0.4)
  other vias: 81.28,7.62
GND16  (via drill 0.4)  (3 unrouted)
  other vias: 73.66,9.53 75.56,9.53 77.47,9.53 79.38,9.53
GND17  (via drill 0.4)
  other vias: 81.28,9.53
GND18  (via drill 0.4)  (3 unrouted)
  other vias: 53.98,18.16 55.88,18.16 57.78,18.16 59.69,18.16
GND19  (via drill 0.4)  (3 unrouted)
  other vias: 74.93,20.07 77.47,20.07 80.01,20.07 82.55,20.07
GND20  (via drill 0.4)  (3 unrouted)
  other vias: 61.59,18.16 63.5,18.16 65.41,18.16 67.31,18.16
GND21  (via drill 0.4)  (3 unrouted)
  other vias: 53.98,20.07 55.88,20.07 57.78,20.07 59.69,20.07
GND22  (via drill 0.4)  (9 unrouted)
  other vias: 61.59,20.07 63.5,20.07 65.41,20.07 67.31,20.07 69.22,20.07 71.12,20.07 73.03,20.07 73.03,18.16 71.12,18.16 69.22,18.16
GND23  (via drill 0.4)
  other vias: 74.93,18.16
GND24  (via drill 0.4)  (3 unrouted)
  other vias: 76.83,18.16 78.74,18.16 80.64,18.16 82.55,18.16
GND26  (via drill 0.4)  (2 unrouted)
  other vias: 43.94,44.96 45.85,44.96 47.75,44.96
GND27  (via drill 0.4)  (2 unrouted)
  other vias: 56.01,43.05 57.91,43.05 59.82,43.05
GND28  (via drill 0.4)  (2 unrouted)
  other vias: 56.01,44.96 57.91,44.96 59.82,44.96
L1  (via drill 1.2 pad 1.42)
  Top 0.305: R3.1 13.01,21.91 | 13.01,21.91 14.61,20.32 14.61,14.61 13.34,13.34 9.88,13.34 U$1.J1.2 | 13.01,21.91 14.8,24.34 14.8,36.26 R18.1 | R22.1 15.48,65.17 14.61,66.04 14.61,69.85 12.7,71.75 9.53,71.75 7.62,73.66 7.62,83.19 7.3,83.5 3.46,83.5 T2.A2
  Top 1.93: T1.A2 10.31,56.03 v14.61,60.33
  Bottom 1.93: X1.1 9.38,13.19 U$1.J1.2 13.01,13.01 14.61,14.61 v14.61,60.33 14.61,69.85 12.7,71.75 9.53,71.75 7.62,73.66 7.62,83.19 7,83.8 T2.A2
MISO
  Top 0.254: IC1.7 44.36,29.4 R9.2
MOSI
  Top 0.254: IC1.6 41.82,29.29 R10.2
N$1
  Top 0.305: R6.2 2.35,35.38 3.17,36.2 9.53,36.2 10.79,34.92 10.79,33.45 OK2.1 11.22,33.02 12.7,33.02 13.34,32.38 13.34,25.4 12.74,24.81 OK1.2
N$2
  Top 0.305: OK1.1 OK2.2 8.68,30.7 8.26,31.11 8.26,33.66 7.62,34.29 6.03,34.29 R1.2
N$3
  Top 0.305: R3.2 R2.1
N$4
  Top 0.305: R2.2 5.93,31.32 R1.1
N$5
  Top 0.305: R5.2 R6.1
N$6
  Top 0.305: R4.2 R5.1
N$7
  Top 0.305: OK3.4 18.58,61.43 17.14,62.87 9.53,62.87 8.26,61.59 3.34,61.59 T1.G
N$8
  Bottom 1.93: X2.1 3.69,50.12 T1.A1
N$9
  Top 0.406: L1.2 57.66,57.24 C6.+ 57.7,51.8 C5.1 56.78,51.7 54.61,49.53 54.61,48.54 IC1.30
N$10
  Top 0.406: JP1.5 48.38,20.44 49.53,21.59 49.53,26.04 R12.2
N$11
  Top 0.406: IC1.12 57.06,32.47 59.05,30.48 59.05,30.11 Q1.2 61.03,24.64 C9.1
N$12
  Top 0.254: C7.1 50.83,52.1 49.53,50.8 49.53,48.54 IC1.32
N$13
  Top 0.406: IC1.13 59.6,32.47 62.87,29.21 65.04,29.21 Q1.1 66.11,24.64 C10.1
N$14
  Top 0.254: JP1.1 47.51,15.36 46.1,16.76 42.29,16.76 41.27,17.78 41.27,24.26 40.39,25.15 40.39,27.69 40.51,27.81 43.94,27.81 44.32,27.43 44.32,26.56 R9.1
N$15
  Top 0.406: JP1.4 42.42,17.9 41.91,18.41 41.91,26.31 R10.1
N$16
  Top 0.254: JP1.3 47.25,17.9 46.35,18.8 46.35,23.11 46.61,23.37 46.61,26.38 R11.1
N$17
  Top 0.254: Q2.B 45.08,90.17 45.09,90.17 45.09,89.51 R15.2
N$18
  Top 0.406: U$2.1 79.09,91.94 DIS1.3
N$19
  Top 0.406: Q5.B 89.9,41.89 90.81,42.8 90.81,43.27 R31.2
N$20
  Top 0.305: OK3.6 16.15,56.35 R19.2
N$21
  Top 0.305: R17.2 R19.1
N$22
  Top 0.305: R17.1 R16.2 15.97,45.72 14.61,45.72 12.06,43.18 12.06,39.37 11.34,38.65 C13.1
N$23
  Top 0.305: R18.2 R16.1
N$24
  Top 0.305: OK4.6 18.66,81.14 R23.2
N$25
  Top 0.305: R21.2 17.23,80.19 R23.1
N$26
  Top 0.305: R20.2 17.14,74.8 | 17.14,74.8 17.14,74.93 16.5,75.56 13.34,75.56 11.25,77.65 C14.1 | 17.14,74.8 R21.1
N$27
  Top 0.254: Q2.C 45.99,96.41 DIS1.16
N$28
  Top 0.305: R22.2 R20.1
N$29
  Top 0.305: OK4.4 17.41,86.22 14.48,89.15 3.27,89.15 T2.G
N$30
  Bottom 1.93: X3.1 3.61,77.88 T2.A1
N$31
  Top 0.254: OK3.1 29.57,56.35 R26.2
N$32
  Top 0.254: OK3.2 29.04,58.89 Q4.C
N$33
  Top 0.406: R27.2 29.56,79.66 OK4.1
N$34
  Top 0.406: OK4.2 30.16,83.68 Q3.C
N$35  (via drill 0.4)
  Top 0.406: Q3.B 34.75,81.87 v34.8,81.92 | v35.43,85.6 35.43,85.85 34.92,86.36 33.88,86.36 R24.2
  Bottom 0.406: v34.8,81.92 34.92,81.92 35.43,82.42 v35.43,85.6
N$36  (via drill 0.4)
  Top 0.254: Q4.B 33.5,58.32 v33.53,58.29 | v27.94,63.88 27.94,63.84 R25.2
  Bottom 0.254: v33.53,58.29 33.53,58.55 v27.94,63.88
N$37
  Top 0.254: U$8.B2 94.55,51.37 94.23,51.05 93.73,51.05 93.09,50.42 92.33,50.42 92.08,50.67 88.14,50.67 88.01,50.55 88.01,49.47 R29.1
N$38
  Top 0.254: R30.1 85.69,48.42 85.98,48.13 93.6,48.13 93.98,48.51 96.01,48.51 96.27,48.77 96.27,48.97 U$8.C1 U$8.B1
N$39
  Top 0.406: IC3.1 84.86,64.36 C15.2
N$40
  Top 0.254: R40.1 36.57,80.92 S3.4 S3.3
N$41
  Top 0.406: C16.2 84.87,69.31 82.42,71.75 81.97,71.75 IC3.4
N$42
  Top 0.254: R41.1 43.69,80.92 S4.4 S4.3
N$43
  Top 0.406: C15.1 84.43,67.21 83.31,68.33 82.86,68.33 IC3.3
N$44
  Top 0.406: C16.1 84.61,72.11 83.44,73.28 83.31,73.28 83.06,73.53 82.73,73.53 IC3.5
N$45
  Top 0.406: IC3.2 79.47,66.89 78.87,66.29 78.87,61.54 C17.1
N$46
  Top 0.406: C18.1 81.81,77.11 IC3.6
N$47
  Top 0.254: R42.1 50.8,80.92 S5.4 S5.3
N$48
  Top 0.254: R43.1 57.91,81.05 S6.4 S6.3
N$49
  Top 0.406: IC3.7 79.79,79.59 78.74,80.64 78.74,83.82 79.38,84.45 83.82,84.45 87,81.28 88.56,81.28 J1.2
N$50
  Top 0.406: IC3.8 84.23,82.14 88.27,78.11 88.92,78.11 J1.3
NEUTRAL  (via drill 1.2)
  Top 0.305: v3.69,18.65 3.58,18.65 2.54,19.68 2.54,22.51 R4.1
  Bottom 1.93: X3.2 10.27,67.62 C14.2 11.25,53.69 C13.2 11.18,53.61 11.18,45.59 10.79,45.21 10.79,45.09 5.54,39.83 X2.2 v3.69,18.65 X1.2 4.25,18.09 U$1.J1.1
RS  (via drill 0.4)
  Top 0.254: IC1.35 41.82,51.35 53.34,62.87 60.96,62.87 61.59,63.5 61.59,71.37 v61.72,71.5 | v70.74,83.95 70.74,92.33 71.75,93.34 73.03,93.34 74.3,94.61 75.95,94.61 76.45,95.12 76.45,96.39 DIS1.4
  Bottom 0.254: v61.72,71.5 63.63,71.5 64.64,72.52 64.64,75.31 67.82,78.49 68.45,78.49 70.36,80.39 70.36,81.41 70.99,82.04 70.99,83.69 v70.74,83.95
RST
  Top 0.254: R12.1 49.44,29.55 IC1.9 49.4,33.25 49.4,34.92 49.02,35.31 41.02,35.31 40.51,34.8 40.51,31.75 40.01,31.24 40.01,29.21 38.77,27.97 C8.1 R8.1 30.34,27.97 S1.2
RST_ESP
  Top 0.406: R31.1 91.03,40.36 89.28,38.61 89.28,34.54 88.01,33.27 77.44,33.27 IC1.20
RTC_BATTERY  (via drill 0.4)
  Top 0.254: U$3.J2.1 91.49,26.67 91.44,26.67 91.44,24.77 90.81,24.13 v87.63,24.13 | v85.09,24.13 69.22,24.13 68.2,23.11 59.82,23.11 59.31,23.62 59.31,28.7 57.91,30.1 57.91,30.35 57.15,31.11 56.39,31.11 55.63,31.88 55.63,37.72 v54.61,38.73 | v50.16,38.73 36.7,38.73 29.21,46.23 29.21,48.37 IC1.40
  Bottom 0.254: v87.63,24.13 v85.09,24.13 | v54.61,38.73 v50.16,38.73
RTC_INT
  Top 0.254: U$3.J2.7 76.29,31.54 76.2,31.62 76.2,41.91 70.36,47.75 70.36,47.86 IC1.24
RW  (via drill 0.4)
  Top 0.254: IC1.34 44.36,51.98 50.8,58.42 50.8,59.05 53.34,61.59 60.96,61.59 62.87,63.5 62.87,76.83 v63.5,77.47 | v69.85,82.55 69.85,93.34 71.12,94.61 72.14,94.61 DIS1.5
  Bottom 0.254: v63.5,77.47 67.94,81.92 69.22,81.92 v69.85,82.55
RX  (via drill 0.4)
  Top 0.254: IC1.14 62.14,43.09 62.23,43.18 62.55,43.5 64.77,45.72 65.41,45.72 66.04,46.35 66.04,51.44 67.94,53.34 v68.45,53.34 | v68.33,55.88 68.33,79.25 71.25,82.17 74.1,82.17 IC3.9
  Bottom 0.254: v68.45,53.34 68.45,55.75 v68.33,55.88
S1  (via drill 0.4)
  Top 0.254: IC1.1 29.12,34.2 30.48,35.56 31.75,35.56 33.02,36.83 v33.02,40.64 | v30.48,46.35 30.48,46.86 30.35,46.99 30.35,48.64 35.31,53.59 38.73,53.59 51.05,65.91 57.91,65.91 58.67,66.67 58.67,70.61 58.04,71.25 40.39,71.25 39.37,72.26 R36.1 C20.2 R40.2
  Bottom 0.254: v33.02,40.64 30.48,43.18 v30.48,46.35
S2  (via drill 0.4)  (2 unrouted)
  Top 0.254: IC1.2 31.66,33.69 33.91,35.94 33.91,39.62 v34.04,39.75 | v33.66,43.81 32.89,44.58 32.89,49.91 35.69,52.7 38.99,52.7 40.01,53.72 40.01,53.98 51.31,65.28 58.67,65.28 59.18,65.79 59.18,70.87 58.29,71.75 47.62,71.75 46.48,72.9 R37.1
  Bottom 0.254: v34.04,39.75 34.04,43.43 v33.66,43.81
S3  (via drill 0.4)
  Top 0.254: IC1.3 34.2,33.82 35.94,35.56 37.34,35.56 v39.12,37.34 | v39.37,41.27 39.37,44.45 38.1,45.72 38.1,50.8 51.44,64.14 59.31,64.14 60.07,64.9 60.07,71.37 59.05,72.39 54.23,72.39 53.85,72.77 53.85,74.42 R38.1 C22.2 R42.2
  Bottom 0.254: v39.12,37.34 39.12,41.02 v39.37,41.27
S4  (via drill 0.4)
  Top 0.254: IC1.4 36.74,33.57 v40.64,37.47 | v40.64,41.27 40.64,52.07 52.07,63.5 59.94,63.5 60.71,64.26 R39.1 C23.2 R43.2
  Bottom 0.254: v40.64,37.47 v40.64,41.27
SCK
  Top 0.254: IC1.8 46.9,29.48 R11.2
SCL  (via drill 0.4)
  Top 0.254: U$3.J2.5 81.37,31.66 v81.28,31.75 | v81.28,34.92 81.28,40.01 80.01,41.27 80.01,48.9 77.47,51.44 74.77,51.44 R14.1 74.75,48.54 IC1.22
  Bottom 0.254: v81.28,31.75 v81.28,34.92
SDA  (via drill 0.4)
  Top 0.254: U$3.J2.4 83.91,31.66 v83.82,31.75 | v83.82,34.92 83.82,40.01 81.28,42.55 81.28,49.02 77.34,52.96 73.03,52.96 72.26,52.2 72.26,51.49 R13.1 72.34,48.49 IC1.23
  Bottom 0.254: v83.82,31.75 v83.82,34.92
TEMP1  (via drill 0.4)
  Top 0.254: U$7.2 30,65.75 30.86,64.9 30.86,61.21 30.48,60.83 30.48,57.91 31.24,57.15 31.24,54.23 v30.86,53.85
  Bottom 0.254: v30.86,53.85 30.86,49.26 IC1.39
TEMP2  (via drill 0.4)
  Top 0.254: v32.38,52.7 34.29,54.61 34.29,55.24 36.2,57.15 36.2,60.96 34.29,62.87 34.29,63.5 33.02,64.77 32.26,64.77 30.99,66.04 30.99,69.6 30.1,70.48 28.26,70.48 U$6.2
  Bottom 0.254: IC1.38 34.2,50.89 v32.38,52.7
TEMP3  (via drill 0.4)
  Top 0.254: U$5.2 36.68,70.63 38.1,69.22 v38.1,63.5
  Bottom 0.254: v38.1,63.5 38.1,51.44 36.83,50.16 36.83,48.54 IC1.37
TEMP4
  Bottom 0.254: IC1.36 39.28,64.22 38.1,65.41 34.28,65.41 U$4.2
TRIAK1  (via drill 0.4)
  Top 0.254: R25.1 32.92,62.33 35.43,60.71 35.43,58.42 v34.67,57.66 | v35.56,51.05 35.56,40.77 36.58,39.75 49.91,39.75 v50.8,40.64 | v53.34,40.64 54.61,40.64 55.88,39.37 v60.96,39.37 | v65.91,39.37 72.39,39.37 74.8,36.96 74.8,33.25 IC1.19
  Bottom 0.254: v34.67,57.66 34.67,51.94 v35.56,51.05 | v50.8,40.64 v53.34,40.64 | v60.96,39.37 v65.91,39.37
TRIAK2  (via drill 0.4)
  Top 0.254: IC1.18 72.3,38.01 v72.39,38.1 | v72.39,41.91 68.45,45.85 68.45,50.16 69.22,50.93 69.22,51.69 v70.61,53.09 | v70.48,57.78 70.48,77.6 71.12,78.23 72.39,78.23 72.52,78.36 75.82,78.36 76.2,78.74 76.2,83.19 75.56,83.82 73.03,83.82 71.75,85.09 v71.75,88.9 | v63.25,90.55 61.34,90.55 60.96,90.17 56.77,90.17 55.37,91.57 48.01,91.57 47.88,91.44 46.99,91.44 46.86,91.31 42.67,91.31 42.55,91.19 33.78,91.19 30.73,88.14 R24.1
  Bottom 0.254: v72.39,38.1 v72.39,41.91 | v70.61,53.09 70.61,57.66 v70.48,57.78 | v71.75,88.9 64.9,88.9 v63.25,90.55
TX  (via drill 0.4)
  Top 0.254: IC1.15 64.68,40.55 v64.77,40.64 | v69.6,55.88 69.6,77.85 71.37,79.63 74.1,79.63 IC3.10
  Bottom 0.254: v64.77,40.64 64.77,42.8 68.45,46.48 68.45,52.07 69.6,53.21 v69.6,55.88
UART1_RX  (via drill 0.4)
  Top 0.254: Q7.3 87.86,56.79 R35.1 85.23,56.52 83.82,56.52 83.19,55.88 v83.19,55.24
  Bottom 0.254: IC1.16 67.22,40.55 72.39,45.72 77.47,45.72 79.38,47.62 79.38,53.98 80.64,55.24 v83.19,55.24
UART1_TX  (via drill 0.4)
  Top 0.254: v80.64,51.44 81.28,52.07 85.43,52.07 R33.1
  Top 0.406: Q6.3 86.23,52.62 R33.1
  Bottom 0.254: IC1.17 69.76,41.19 73.03,44.45 78.11,44.45 80.64,46.99 v80.64,51.44
ZERO_CROSS_INT
  Top 0.305: OK2.4 18.63,35.81 R7.1
  Bottom 0.305: OK1.4 21,27.35 21.59,27.94 21.59,32.38 20.95,33.02 18.84,33.02 OK2.4
(copper drawn outside any net)
  shapes: Top area x3